# Altium schematic sheet 03_SRAD_Current_Amplification.SchDoc
size A4; DocumentNumber: 3; SheetNumber: 3; SheetTotal: 4
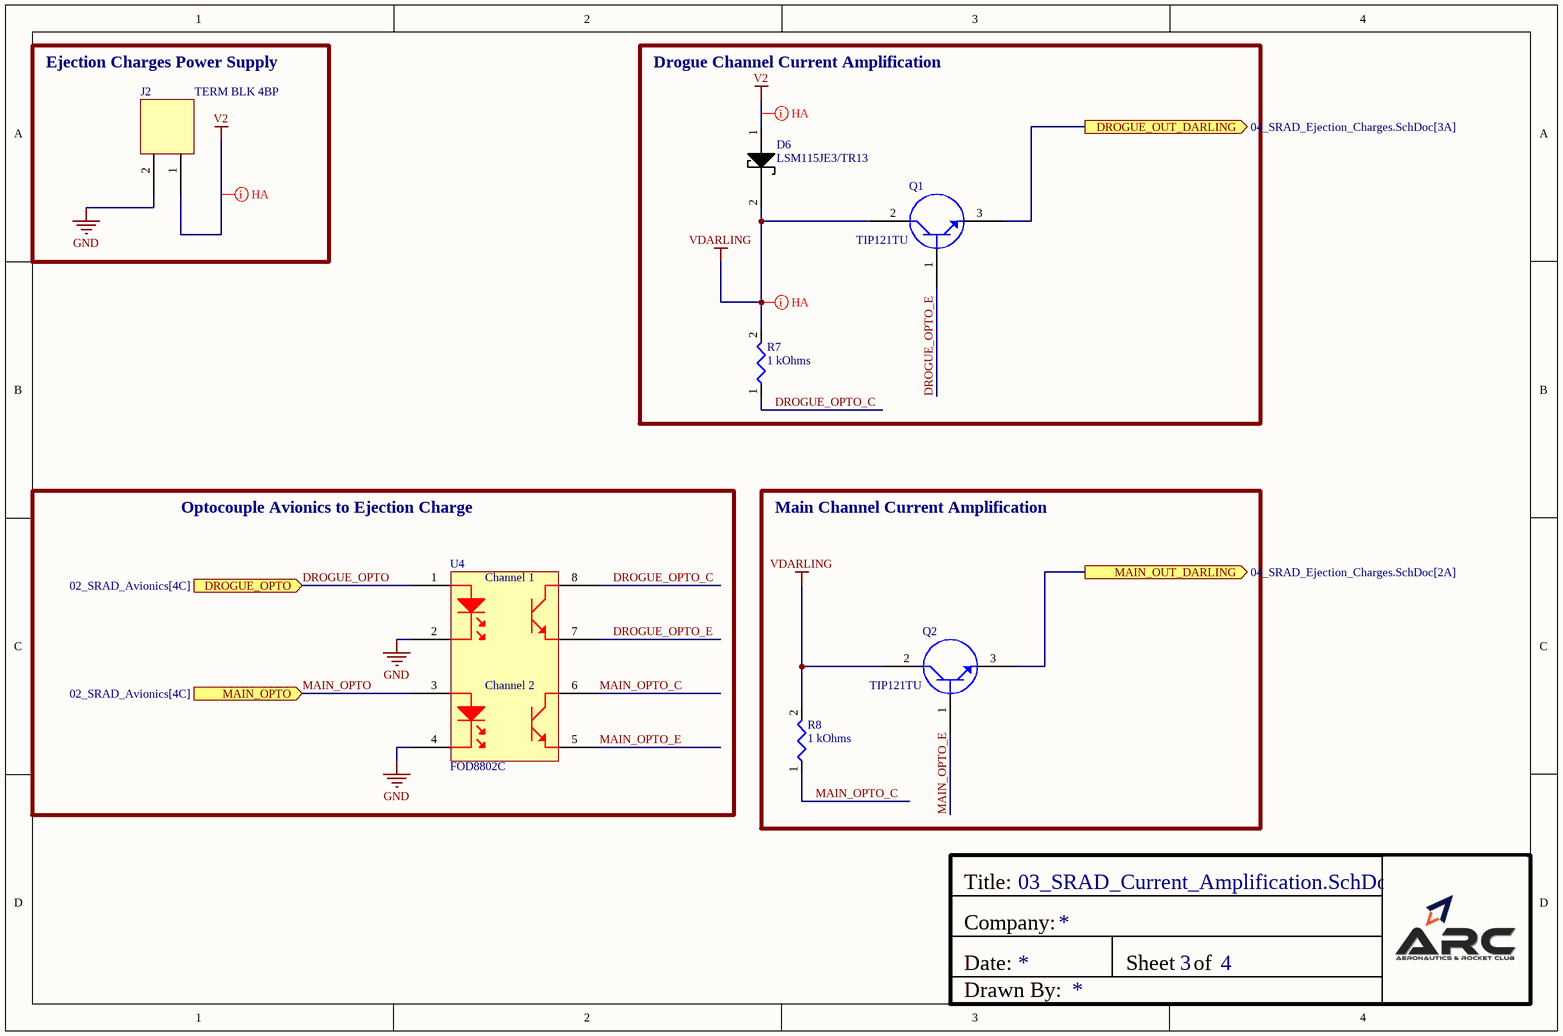
[diagram p0: 03_SRAD_Current_Amplification.SchDoc]

## Parts
D6  LSM115JE3/TR13  [DIOM4336X33N]
J2  TERM BLK 4BP  [PCB TERM BLK 2P 2.54MM]
Q1  TIP121TU  [TIP121TU DARLINGTON]
Q2  TIP121TU  [TIP121TU DARLINGTON]
R7  1 kOhms  [RESC2012X06N]
R8  1 kOhms  [RESC2012X06N]
U4  FOD8802C  [SOIC127P590X363-8N OPTO]

## Blocks framed on the sheet
Ejection Charges Power Supply: J2
Drogue Channel Current Amplification: D6 Q1 R7
Optocouple Avionics to Ejection Charge: U4
Main Channel Current Amplification: Q2 R8

## Ports
DROGUE_OPTO (in, see 02_SRAD_Avionics[4C]), DROGUE_OUT_DARLING (out, see 04_SRAD_Ejection_Charges.SchDoc[3A]), MAIN_OPTO (in, see 02_SRAD_Avionics[4C]), MAIN_OUT_DARLING (out, see 04_SRAD_Ejection_Charges.SchDoc[2A])

## Nets
GND: J2.2(-) U4.2(-) U4.4(-)
V2: D6.1(+) J2.1(+)
VDARLING: D6.2(-) Q1.2(C) Q2.2(C) R7.2 R8.2
DROGUE_OPTO: U4.1(+) ; port DROGUE_OPTO
DROGUE_OPTO_C: R7.1 U4.8(C1)
DROGUE_OPTO_E: Q1.1(B) U4.7(E1)
DROGUE_OUT_DARLING: Q1.3(E) ; port DROGUE_OUT_DARLING
MAIN_OPTO: U4.3(+) ; port MAIN_OPTO
MAIN_OPTO_C: R8.1 U4.6(C2)
MAIN_OPTO_E: Q2.1(B) U4.5(E2)
MAIN_OUT_DARLING: Q2.3(E) ; port MAIN_OUT_DARLING

## Layout directives
rule Width Constraint [Pref Width = 1mm    Min Width = 0.3mm    Max Width = 1mm]: V2, VDARLING

## Notes on the sheet
- Title:
- Company:
- Date:
- Sheet
- of
- Drawn By:
- (in symbol FOD8802C) Channel 1; Channel 2

## Library data of the parts
D6 = DIOM4336X33N Schottky Diode: Diode 15 V 1A Surface Mount DO-214BA 220mV dropout @1A 10mA leakage current @15V -55°C ~ 150°C Maximum surge current of 50A for 8.3ms; Manufacturer: Microchip; Supplier 1: Digi-Key; Manufacturer Part Number: LSM115JE3/TR13; RoHS: Yes; Category: Rectifier Diodes; Stock 1: 319959; Pricing 1: 3000=0.55500 (USD); Supplier Part Number 1: 150-LSM115JE3/TR13TR-ND
J2 = PCB TERM BLK 2P 2.54MM: 2 Position Wire to Board Terminal Block Horizontal with Board 0.100" (2.54mm) Through Hole 10A 150V 16-30 AWG 0.2 Nm M1.6 screw -40°C ~ 105°C; Manufacturer: TE Connectivity; Manufacturer Part Number: 282834-2; Plating: Brass,Steel; Number of Poles: 2; Gender: Male; Number of Levels: 1; Connector Type: Receptacle; Closed End: No (Without); Screwless Terminal Block: Yes (With); Wire Gauge (Max): 30AWG; Tail Length: 3.4mm; Approvals: UL; Supplier 1: Digi-Key; RoHS: Yes; Category: Terminal Blocks; Stock 1: 34508; Pricing 1: 1=1.95000, 10=1.47400, 25=1.36640, 50=1.22860, 100=1.19860, 250=1.04876, 500=0.95886, 1000=0.86896, 5000=0.76409 (USD); Mounting Technology: Through Hole; Contact Plating: Tin; Contact Material: Brass; Color: Green; Material: Nylon; Housing Color: Green; Housing Material: Polyamide; Min Operating Temperature: -40°C; Max Operating Temperature: 105°C; Number of Rows: 1; Max Voltage Rating (AC): 150V; Current Rating: 10A; Voltage Rating: 150V; Package Quantity: 300; Packaging: Bulk; Number of Positions: 2; Termination: Solder; Number of Positions Per Level: 2; Current: 10A; Voltage: 150V; Max Supply Voltage (AC): 150V; Number of Contacts: 2; Number of Circuits: 2; Orientation: Straight; Max Current Rating: 10A; Interlock: No (Without); Screw Flange: No (Without); Side Stackable: Yes (With); Series: Buchanan; Length: 5.54mm; Width: 6.5mm; Wire Gauge (Min): 30AWG; Wire/Cable Gauge: 30AWG; Pitch: 2.54mm; Thread Size: M1.6; Depth: 6.5mm; Radiation Hardening: No; ELV: Compliant; Lead Free: Lead Free; Flammability Rating: UL94 V-0; RoHS Compliant: Yes; ComponentLink1URL: https://datasheet.ciiva.com/16386/282834-2-16386363.pdf?src-supplier=Future+Electronics; ComponentLink1Description: https://datasheet.ciiva.com/16386/282834-2-16386363.pdf?src-supplier=Future+Electronics; ComponentLink2URL: https://datasheet.ciiva.com/30166/eng-cs-1308389-eurostyle-terminal-blocks-0607-30166974.pdf?src-supplier=Onlinecomponents.com; ComponentLink2Description: https://datasheet.ciiva.com/30166/eng-cs-1308389-eurostyle-terminal-blocks-0607-30166974.pdf?src-supplier=Onlinecomponents.com; ComponentLink3URL: https://datasheet.ciiva.com/14609/70086732-14609670.pdf?src-supplier=Allied+Electronics; ComponentLink3Description: https://datasheet.ciiva.com/14609/70086732-14609670.pdf?src-supplier=Allied+Electronics; ComponentLink4URL: https://datasheet.ciiva.com/15169/getdatasheetpartid-155864-15169558.pdf?src-supplier=Verical; ComponentLink4Description: https://datasheet.ciiva.com/15169/getdatasheetpartid-155864-15169558.pdf?src-supplier=Verical; ComponentLink5URL: https://datasheet.ciiva.com/3141/eng-cs-1308389-eurostyle-terminal-blocks-0607-3141115.pdf?src-supplier=Avnet; ComponentLink5Description: https://datasheet.ciiva.com/3141/eng-cs-1308389-eurostyle-terminal-blocks-0607-3141115.pdf?src-supplier=Avnet; Supplier Part Number 1: A98333-ND
Q1 Q2 = TIP121TU: Bipolar (BJT) Transistor NPN - Darlington 80 V 5 A 2 W Through Hole TO-220-3; Manufacturer: ON Semiconductor / Fairchild; Collector Emitter Voltage (VCEO): 80V; Emitter Base Voltage (VEBO): 5V; Max Collector Current: 5A; Max Power Dissipation: 2W; Number of Elements: 1; Collector Emitter Saturation Voltage: 2V; Element Configuration: Single; hFE Min: 1000; Collector-emitter Voltage-Max: 4V; Supplier 1: Mouser; Manufacturer Part Number: TIP121TU; RoHS: Yes; Category: BJTs; Stock 1: 1945; Pricing 1: 1=0.89000, 10=0.79300, 50=0.79300, 100=0.61300, 1000=0.43800, 10000=0.40800 (USD); Mounting Technology: Through Hole; Case/Package: TO-220AB; Pins: 3; Weight: 1.214g; Contact Plating: Tin,Matte; Min Operating Temperature: -65°C; Max Operating Temperature: 150°C; Packaging: Rail/Tube; Package Quantity: 50; Polarity: NPN; Collector Base Voltage (VCBO): 80V; Collector Emitter Breakdown Voltage: 80V; Power Dissipation: 2W; Voltage Rating (DC): 80V; Current Rating: 5A; Series: -; Length: 10.67mm; Width: 4.83mm; Height: 16.51mm; Radiation Hardening: No; Lead Free: Lead Free; RoHS Compliant: Yes; ComponentLink1URL: https://datasheet.ciiva.com/4459/tip121-197068-4459491.pdf?src-supplier=Mouser; ComponentLink1Description: https://datasheet.ciiva.com/4459/tip121-197068-4459491.pdf?src-supplier=Mouser; ComponentLink2URL: https://datasheet.ciiva.com/979/tip122-979470.pdf?src-supplier=Digi-Key; ComponentLink2Description: https://datasheet.ciiva.com/979/tip122-979470.pdf?src-supplier=Digi-Key; ComponentLink3URL: https://datasheet.ciiva.com/11211/tip121-11211002.pdf?src-supplier=Avnet; ComponentLink3Description: https://datasheet.ciiva.com/11211/tip121-11211002.pdf?src-supplier=Avnet; Supplier Part Number 1: 512-TIP121TU
R7 R8 = RC0805FR-7W1KL Yageo: 1 kOhms ±1% 0.25W, 1/4W Chip Resistor 0805 (2012 Metric) Moisture Resistant Thick Film; Manufacturer: Yageo; Value: 1kR; Supplier 1: Digi-Key; Manufacturer Part Number: RC0805FR-7W1KL; RoHS: Yes; Category: Chip SMD Resistors; Stock 1: 15000; Pricing 1: 5000=0.01838, 10000=0.01715, 25000=0.01629, 50000=0.01596, 125000=0.01562 (USD); Case/Package: 0805; Tolerance: 1%; RoHS Compliant: Yes; Supplier Part Number 1: 13-RC0805FR-7W1KLTR-ND
U4 = FOD8802C: Optoisolator Transistor Output 2500Vrms 2 Channel 8-SOIC 75V max 30mA/channel Vf 1.35V -40°C ~ 125°C minimum CTR of / 140% @ 1mA maximum CTR of / 380% @ 1mA; Manufacturer: ON Semiconductor; Supplier 1: Digi-Key; Manufacturer Part Number: FOD8802C; RoHS: No; Category: Optocouplers; Stock 1: 2868; Pricing 1: 1=1.72000, 10=1.54500, 25=1.45760, 100=1.24180, 250=1.16600, 500=1.02024, 1000=0.84535, 2500=0.78705, 5000=0.75790 (USD); Supplier Part Number 1: 488-FOD8802C-ND